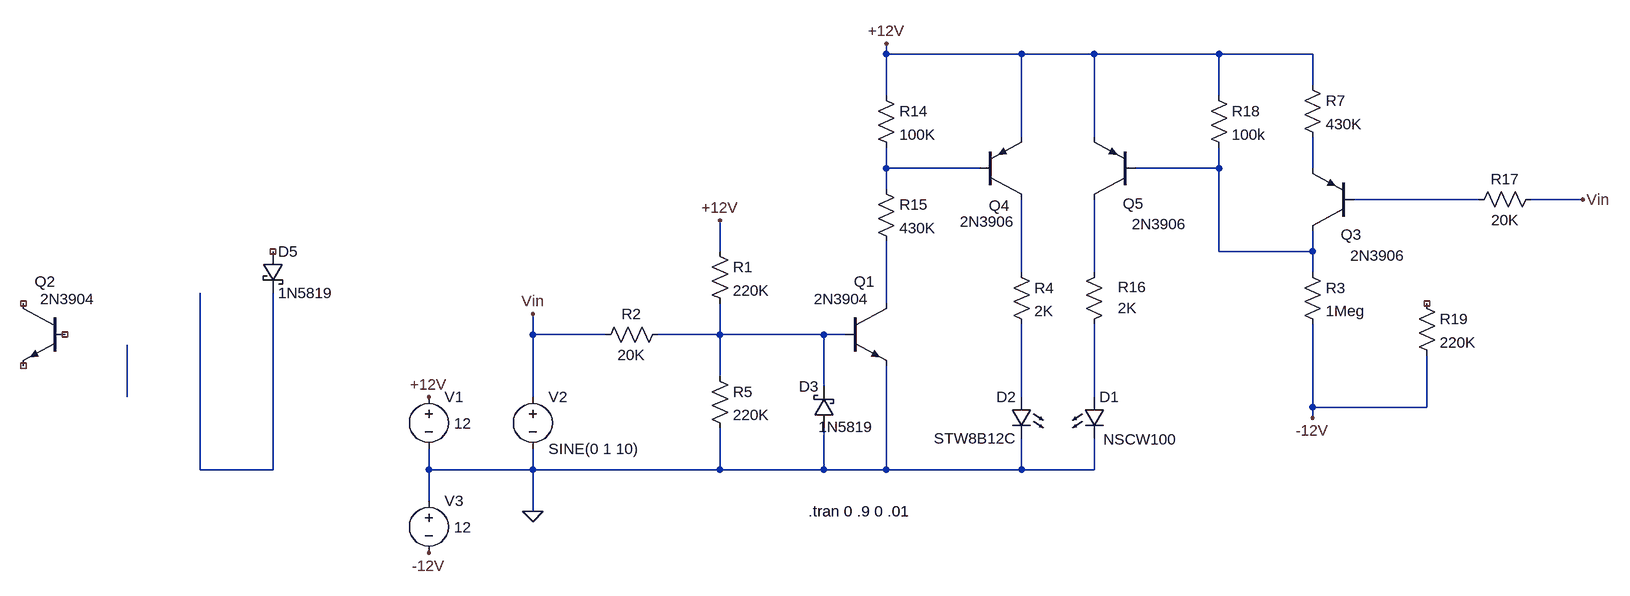
[diagram p0: schematic sigmon_ccath.asc]
sigmon_ccath.asc, the LTspice schematic file:
Version 4
SHEET 1 1672 1940
WIRE 240 -128 240 -144
WIRE 448 -128 240 -128
WIRE 560 -128 448 -128
WIRE 752 -128 560 -128
WIRE 896 -128 752 -128
WIRE 896 -80 896 -128
WIRE 240 -64 240 -128
WIRE 752 -64 752 -128
WIRE 448 0 448 -128
WIRE 560 0 560 -128
WIRE 240 48 240 16
WIRE 384 48 240 48
WIRE 752 48 752 16
WIRE 752 48 624 48
WIRE 896 48 896 0
WIRE 240 80 240 48
WIRE 1152 96 960 96
WIRE 1312 96 1232 96
WIRE -16 176 -16 128
WIRE 752 176 752 48
WIRE 896 176 896 144
WIRE 896 176 752 176
WIRE 448 208 448 96
WIRE 560 208 560 96
WIRE 896 208 896 176
WIRE 240 256 240 160
WIRE -304 304 -304 272
WIRE -192 304 -304 304
WIRE -16 304 -16 256
WIRE -16 304 -112 304
WIRE 144 304 -16 304
WIRE 176 304 144 304
WIRE -16 368 -16 304
WIRE 144 384 144 304
WIRE -928 400 -928 320
WIRE -304 400 -304 304
WIRE 448 400 448 288
WIRE 560 400 560 288
WIRE 896 416 896 288
WIRE 1072 416 1072 336
WIRE 1072 416 896 416
WIRE 896 432 896 416
WIRE -816 512 -816 240
WIRE -704 512 -704 240
WIRE -704 512 -816 512
WIRE -464 512 -464 480
WIRE -304 512 -304 480
WIRE -304 512 -464 512
WIRE -16 512 -16 448
WIRE -16 512 -304 512
WIRE 144 512 144 448
WIRE 144 512 -16 512
WIRE 240 512 240 352
WIRE 240 512 144 512
WIRE 448 512 448 464
WIRE 448 512 240 512
WIRE 560 512 560 464
WIRE 560 512 448 512
WIRE -464 560 -464 512
WIRE -304 576 -304 512
FLAG -464 400 +12V
FLAG -16 128 +12V
FLAG -304 272 Vin
FLAG -464 640 -12V
FLAG 240 -144 +12V
FLAG -304 576 0
FLAG 1312 96 Vin
FLAG 896 432 -12V
SYMBOL LED 544 400 R0
WINDOW 3 30 65 Left 2
SYMATTR InstName D1
SYMATTR Value NSCW100
SYMBOL LED 464 400 M0
SYMATTR InstName D2
SYMATTR Value STW8B12C
SYMBOL npn 176 256 R0
WINDOW 0 14 -34 Left 2
WINDOW 3 -47 -7 Left 2
SYMATTR InstName Q1
SYMATTR Value 2N3904
SYMBOL res -32 160 R0
SYMATTR InstName R1
SYMATTR Value 220K
SYMBOL res -96 288 R90
WINDOW 0 0 56 VBottom 2
WINDOW 3 32 56 VTop 2
SYMATTR InstName R2
SYMATTR Value 20K
SYMBOL voltage -464 384 R0
WINDOW 3 39 57 Left 2
WINDOW 123 0 0 Left 0
WINDOW 39 0 0 Left 0
SYMATTR InstName V1
SYMATTR Value 12
SYMBOL voltage -304 384 R0
WINDOW 123 0 0 Left 0
WINDOW 39 0 0 Left 0
SYMATTR InstName V2
SYMATTR Value SINE(0 1 10)
SYMBOL res 432 192 R0
SYMATTR InstName R4
SYMATTR Value 2K
SYMBOL res -32 352 R0
SYMATTR InstName R5
SYMATTR Value 220K
SYMBOL voltage -464 544 R0
WINDOW 3 39 57 Left 2
WINDOW 123 0 0 Left 0
WINDOW 39 0 0 Left 0
SYMATTR InstName V3
SYMATTR Value 12
SYMBOL schottky 160 448 R180
WINDOW 0 24 64 Left 2
WINDOW 3 -60 2 Left 2
SYMATTR InstName D3
SYMATTR Value 1N5819
SYMATTR Description Diode
SYMATTR Type diode
SYMBOL pnp 384 96 M180
WINDOW 0 14 -9 Left 2
WINDOW 3 -31 -34 Left 2
SYMATTR InstName Q4
SYMATTR Value 2N3906
SYMBOL res 224 -80 R0
SYMATTR InstName R14
SYMATTR Value 100K
SYMBOL res 224 64 R0
SYMATTR InstName R15
SYMATTR Value 430K
SYMBOL res 576 192 M0
WINDOW 0 -65 39 Left 2
WINDOW 3 -50 71 Left 2
SYMATTR InstName R16
SYMATTR Value 2K
SYMBOL pnp 624 96 R180
WINDOW 0 -12 -6 Left 2
WINDOW 3 -79 -38 Left 2
SYMATTR InstName Q5
SYMATTR Value 2N3906
SYMBOL res 1248 80 R90
WINDOW 0 0 56 VBottom 2
WINDOW 3 32 56 VTop 2
SYMATTR InstName R17
SYMATTR Value 20K
SYMBOL res 736 -80 R0
SYMATTR InstName R18
SYMATTR Value 100k
SYMBOL schottky -720 176 R0
SYMATTR InstName D5
SYMATTR Value 1N5819
SYMATTR Description Diode
SYMATTR Type diode
SYMBOL res 1056 240 R0
SYMATTR InstName R19
SYMATTR Value 220K
SYMBOL npn -1024 256 M0
WINDOW 0 14 -34 Left 2
WINDOW 3 -47 -7 Left 2
SYMATTR InstName Q2
SYMATTR Value 2N3904
SYMBOL pnp 960 144 R180
WINDOW 0 -12 -6 Left 2
WINDOW 3 -79 -38 Left 2
SYMATTR InstName Q3
SYMATTR Value 2N3906
SYMBOL res 880 192 R0
SYMATTR InstName R3
SYMATTR Value 1Meg
SYMBOL res 880 -96 R0
SYMATTR InstName R7
SYMATTR Value 430K
TEXT 120 576 Left 2 !.tran 0 .9 0 .01

The netlist it stands for:
* sigmon_ccath.asc
D1 N011 0 NSCW100
D2 N010 0 STW8B12C
Q1 N007 N008 0 0 2N3904
R1 +12V N008 220K
R2 N008 Vin 20K
V1 +12V 0 12
V2 Vin 0 SINE(0 1 10)
R4 N005 N010 2K
R5 N008 0 220K
V3 0 -12V 12
D3 0 N008 1N5819
Q4 N005 N001 +12V 0 2N3906
R14 +12V N001 100K
R15 N001 N007 430K
R16 N006 N011 2K
Q5 N006 N002 +12V 0 2N3906
R17 Vin N004 20K
R18 +12V N002 100k
D5 NC_01 N012 1N5819
R19 NC_02 -12V 220K
Q2 NC_03 NC_04 NC_05 0 2N3904
Q3 N002 N004 N003 0 2N3906
R3 N002 -12V 1Meg
R7 +12V N003 430K
.model D D
.lib standard.dio
.model NPN NPN
.model PNP PNP
.lib standard.bjt
.tran 0 .9 0 .01
.backanno
.end